# EAGLE design Stepper_1_0 (EAGLE 8.0.0)
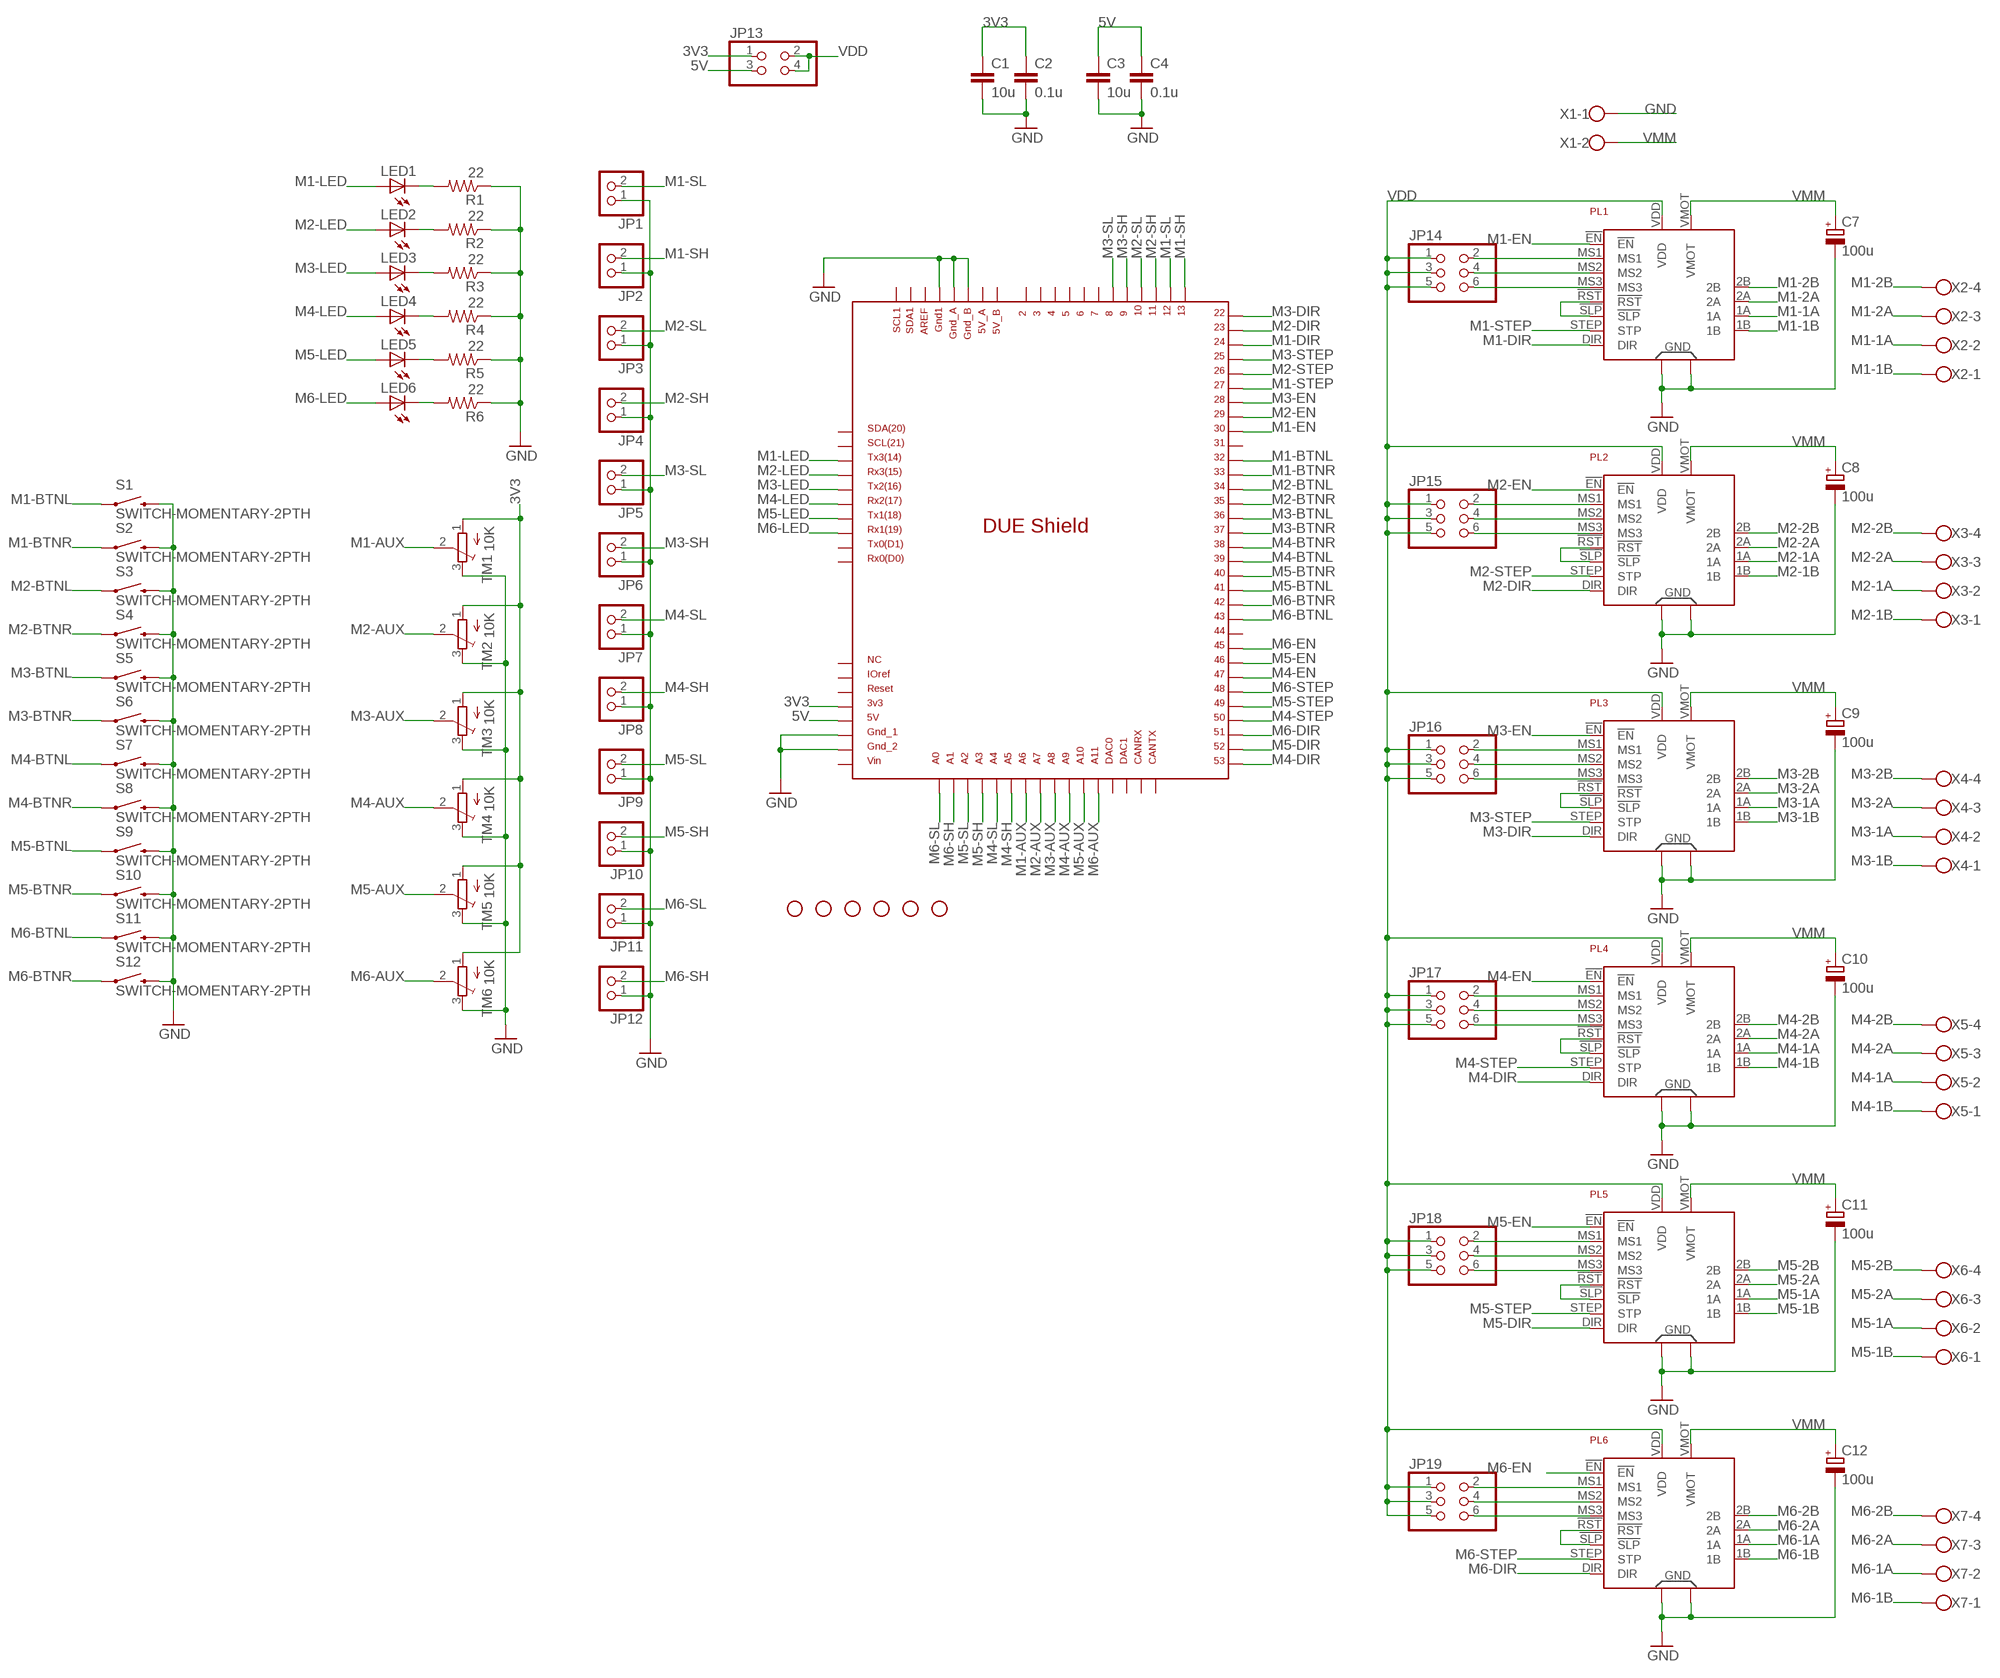
[diagram p0: schematic, sheet 1]

## Parts
C1  10u  CAP1206  [1206]
C2  0.1u  CAP1206  [1206]
C3  10u  CAP1206  [1206]
C4  0.1u  CAP1206  [1206]
C7  100u  CPOL-EUETR2  [ETR2]
C8  100u  CPOL-EUETR2  [ETR2]
C9  100u  CPOL-EUETR2  [ETR2]
C10  100u  CPOL-EUETR2  [ETR2]
C11  100u  CPOL-EUETR2  [ETR2]
C12  100u  CPOL-EUETR2  [ETR2]
H1  STAND-OFF  [STAND-OFF]
H2  STAND-OFF  [STAND-OFF]
H3  STAND-OFF  [STAND-OFF]
H4  STAND-OFF  [STAND-OFF]
H5  STAND-OFF  [STAND-OFF]
H6  STAND-OFF  [STAND-OFF]
JP1  PINHD-1X2  [1X02]
JP2  PINHD-1X2  [1X02]
JP3  PINHD-1X2  [1X02]
JP4  PINHD-1X2  [1X02]
JP5  PINHD-1X2  [1X02]
JP6  PINHD-1X2  [1X02]
JP7  PINHD-1X2  [1X02]
JP8  PINHD-1X2  [1X02]
JP9  PINHD-1X2  [1X02]
JP10  PINHD-1X2  [1X02]
JP11  PINHD-1X2  [1X02]
JP12  PINHD-1X2  [1X02]
JP13  PINHD-2X2  [2X02]
JP14  PINHD-2X3  [2X03]
JP15  PINHD-2X3  [2X03]
JP16  PINHD-2X3  [2X03]
JP17  PINHD-2X3  [2X03]
JP18  PINHD-2X3  [2X03]
JP19  PINHD-2X3  [2X03]
LED1  LEDSMT1206  [1206]
LED2  LEDSMT1206  [1206]
LED3  LEDSMT1206  [1206]
LED4  LEDSMT1206  [1206]
LED5  LEDSMT1206  [1206]
LED6  LEDSMT1206  [1206]
PL1  A4988X  [MD09X]
PL2  A4988X  [MD09X]
PL3  A4988X  [MD09X]
PL4  A4988X  [MD09X]
PL5  A4988X  [MD09X]
PL6  A4988X  [MD09X]
R1  22  RESISTOR1206  [1206]
R2  22  RESISTOR1206  [1206]
R3  22  RESISTOR1206  [1206]
R4  22  RESISTOR1206  [1206]
R5  22  RESISTOR1206  [1206]
R6  22  RESISTOR1206  [1206]
S1  SWITCH-MOMENTARY-2PTH  [TACTILE-PTH]
S2  SWITCH-MOMENTARY-2PTH  [TACTILE-PTH]
S3  SWITCH-MOMENTARY-2PTH  [TACTILE-PTH]
S4  SWITCH-MOMENTARY-2PTH  [TACTILE-PTH]
S5  SWITCH-MOMENTARY-2PTH  [TACTILE-PTH]
S6  SWITCH-MOMENTARY-2PTH  [TACTILE-PTH]
S7  SWITCH-MOMENTARY-2PTH  [TACTILE-PTH]
S8  SWITCH-MOMENTARY-2PTH  [TACTILE-PTH]
S9  SWITCH-MOMENTARY-2PTH  [TACTILE-PTH]
S10  SWITCH-MOMENTARY-2PTH  [TACTILE-PTH]
S11  SWITCH-MOMENTARY-2PTH  [TACTILE-PTH]
S12  SWITCH-MOMENTARY-2PTH  [TACTILE-PTH]
SH1  DUE(NOSPI)  [DUE(NOSPI)]
TM1  10K  TRIMPOTTC33X  [TC33X]
TM2  10K  TRIMPOTTC33X  [TC33X]
TM3  10K  TRIMPOTTC33X  [TC33X]
TM4  10K  TRIMPOTTC33X  [TC33X]
TM5  10K  TRIMPOTTC33X  [TC33X]
TM6  10K  TRIMPOTTC33X  [TC33X]
X1  W237-102  [W237-102]
X2  W237-4  [W237-4]
X3  W237-4  [W237-4]
X4  W237-4  [W237-4]
X5  W237-4  [W237-4]
X6  W237-4  [W237-4]
X7  W237-4  [W237-4]

## Nets
3V3: C1.1 C2.1 JP13.1 SH1.3V3 TM1.1(A) TM2.1(A) TM3.1(A) TM4.1(A) TM5.1(A) TM6.1(A)
5V: C3.1 C4.1 JP13.3 SH1.5V
GND: C1.2 C2.2 C3.2 C4.2 C7.- C8.- C9.- C10.- C11.- C12.- JP1.1 JP2.1 JP3.1 JP4.1 JP5.1 JP6.1 JP7.1 JP8.1 JP9.1 JP10.1 JP11.1 JP12.1 PL1.GND1 PL1.GND2 PL2.GND1 PL2.GND2 PL3.GND1 PL3.GND2 PL4.GND1 PL4.GND2 PL5.GND1 PL5.GND2 PL6.GND1 PL6.GND2 R1.1 R2.1 R3.1 R4.1 R5.1 R6.1 S1.3 S2.3 S3.3 S4.3 S5.3 S6.3 S7.3 S8.3 S9.3 S10.3 S11.3 S12.3 SH1.GND1 SH1.GND_1 SH1.GND_2 SH1.GND_A SH1.GND_B TM1.3(E) TM2.3(E) TM3.3(E) TM4.3(E) TM5.3(E) TM6.3(E) X1.1
M1-1A: PL1.1A X2.2
M1-1B: PL1.1B X2.1
M1-2A: PL1.2A X2.3
M1-2B: PL1.2B X2.4
M1-AUX: SH1.A6 TM1.2(S)
M1-BTNL: S1.1 SH1.32
M1-BTNR: S2.1 SH1.33
M1-DIR: PL1.DIR SH1.24
M1-EN: PL1.!EN SH1.30
M1-LED: LED1.A SH1.TX3
M1-SH: JP2.2 SH1.13
M1-SL: JP1.2 SH1.12
M1-STEP: PL1.STEP(STP) SH1.27
M2-1A: PL2.1A X3.2
M2-1B: PL2.1B X3.1
M2-2A: PL2.2A X3.3
M2-2B: PL2.2B X3.4
M2-AUX: SH1.A7 TM2.2(S)
M2-BTNL: S3.1 SH1.34
M2-BTNR: S4.1 SH1.35
M2-DIR: PL2.DIR SH1.23
M2-EN: PL2.!EN SH1.29
M2-LED: LED2.A SH1.RX3
M2-SH: JP4.2 SH1.11
M2-SL: JP3.2 SH1.10
M2-STEP: PL2.STEP(STP) SH1.26
M3-1A: PL3.1A X4.2
M3-1B: PL3.1B X4.1
M3-2A: PL3.2A X4.3
M3-2B: PL3.2B X4.4
M3-AUX: SH1.A8 TM3.2(S)
M3-BTNL: S5.1 SH1.36
M3-BTNR: S6.1 SH1.37
M3-DIR: PL3.DIR SH1.22
M3-EN: PL3.!EN SH1.28
M3-LED: LED3.A SH1.TX2
M3-SH: JP6.2 SH1.9
M3-SL: JP5.2 SH1.8
M3-STEP: PL3.STEP(STP) SH1.25
M4-1A: PL4.1A X5.2
M4-1B: PL4.1B X5.1
M4-2A: PL4.2A X5.3
M4-2B: PL4.2B X5.4
M4-AUX: SH1.A9 TM4.2(S)
M4-BTNL: S7.1 SH1.39
M4-BTNR: S8.1 SH1.38
M4-DIR: PL4.DIR SH1.53
M4-EN: PL4.!EN SH1.47
M4-LED: LED4.A SH1.RX2
M4-SH: JP8.2 SH1.A5
M4-SL: JP7.2 SH1.A4
M4-STEP: PL4.STEP(STP) SH1.50
M5-1A: PL5.1A X6.2
M5-1B: PL5.1B X6.1
M5-2A: PL5.2A X6.3
M5-2B: PL5.2B X6.4
M5-AUX: SH1.A10 TM5.2(S)
M5-BTNL: S9.1 SH1.41
M5-BTNR: S10.1 SH1.40
M5-DIR: PL5.DIR SH1.52
M5-EN: PL5.!EN SH1.46
M5-LED: LED5.A SH1.TX1
M5-SH: JP10.2 SH1.A3
M5-SL: JP9.2 SH1.A2
M5-STEP: PL5.STEP(STP) SH1.49
M6-1A: PL6.1A X7.2
M6-1B: PL6.1B X7.1
M6-2A: PL6.2A X7.3
M6-2B: PL6.2B X7.4
M6-AUX: SH1.A11 TM6.2(S)
M6-BTNL: S11.1 SH1.43
M6-BTNR: S12.1 SH1.42
M6-DIR: PL6.DIR SH1.51
M6-EN: PL6.!EN SH1.45
M6-LED: LED6.A SH1.RX1
M6-SH: JP12.2 SH1.A1
M6-SL: JP11.2 SH1.A0
M6-STEP: PL6.STEP(STP) SH1.48
N$1: JP15.2 PL2.MS1
N$6: PL1.!RST PL1.!SLP
N$7: JP15.6 PL2.MS3
N$8: JP15.4 PL2.MS2
N$13: PL2.!RST PL2.!SLP
N$14: PL3.!RST PL3.!SLP
N$15: JP16.6 PL3.MS3
N$16: JP16.4 PL3.MS2
N$21: PL4.!RST PL4.!SLP
N$22: JP14.6 PL1.MS3
N$23: JP14.4 PL1.MS2
N$24: JP14.2 PL1.MS1
N$26: JP16.2 PL3.MS1
N$33: JP17.6 PL4.MS3
N$34: JP17.4 PL4.MS2
N$35: JP17.2 PL4.MS1
N$37: JP18.6 PL5.MS3
N$38: JP18.4 PL5.MS2
N$39: JP18.2 PL5.MS1
N$44: JP19.6 PL6.MS3
N$45: JP19.4 PL6.MS2
N$46: JP19.2 PL6.MS1
N$47: PL5.!RST PL5.!SLP
N$48: PL6.!RST PL6.!SLP
N$49: LED1.C R1.2
N$50: LED2.C R2.2
N$51: LED3.C R3.2
N$52: LED4.C R4.2
N$53: LED5.C R5.2
N$54: LED6.C R6.2
VDD: JP13.2 JP13.4 JP14.1 JP14.3 JP14.5 JP15.1 JP15.3 JP15.5 JP16.1 JP16.3 JP16.5 JP17.1 JP17.3 JP17.5 JP18.1 JP18.3 JP18.5 JP19.1 JP19.3 JP19.5 PL1.VDD PL2.VDD PL3.VDD PL4.VDD PL5.VDD PL6.VDD
VMM: C7.+ C8.+ C9.+ C10.+ C11.+ C12.+ PL1.VMOT PL2.VMOT PL3.VMOT PL4.VMOT PL5.VMOT PL6.VMOT X1.2
Unconnected: SH1.2 SH1.3 SH1.4 SH1.5 SH1.5V_A SH1.5V_B SH1.6 SH1.7 SH1.31 SH1.44 SH1.AREF SH1.CANRX SH1.CANTX SH1.DAC0 SH1.DAC1 SH1.IOREF SH1.NC SH1.RESET SH1.RX0 SH1.SCL SH1.SCL1 SH1.SDA SH1.SDA1 SH1.TX0 SH1.VIN

## Library data of the parts
C1-C4 = SparkFun-Passives:CAP: Capacitor Standard 0603 ceramic capacitor, and 0.1" leaded capacitor.
C7-C12 = rcl:CPOL-EU: POLARIZED CAPACITOR, European symbol
H1-H6 = SparkFun-Electromechanical:STAND-OFF: #4 Stand Off This is the mechanical footprint for a #4 phillips button head screw. Use the keepout ring to avoid running the screw head into surrounding components. SKU : PRT-00447
JP1-JP12 = pinhead:PINHD-1X2: PIN HEADER
JP13 = pinhead:PINHD-2X2: PIN HEADER
JP14-JP19 = pinhead:PINHD-2X3: PIN HEADER
LED1-LED6 = adafruit:LED: LED OSRAM: - CHIPLED LG R971, LG N971, LY N971, LG Q971, LY Q971, LO R971, LY R971 LH N974, LH R974 LS Q976, LO Q976, LY Q976 LO Q996 - Hyper CHIPLED LW Q18S LB Q993, LB Q99A, LB R99A - SideLED LS A670, LO A670, LY A670, LG A670, LP A670 LB A673, LV A673, LT A673, LW A673 LH A674 LY A675 LS A676, LA A676, LO A676, LY A676, LW A676 LS A679, LY A679, LG A679 - Hyper Micro SIDELED® LS Y876, LA Y876, LO Y876, LY Y876 LT Y87S - SmartLED LW L88C, LW L88S LB L89C, LB L89S, LG L890 LS L89K, LO L89K, LY L89K LS L896, LA L896, LO L896, LY L896 - TOPLED LS T670, LO T670, LY T670, LG T670, LP T670 LSG T670, LSP T670, LSY T670, LOP T670, LYG T670 LG T671, LOG T671, LSG T671 LB T673, LV T673, LT T673, LW T673 LH T674 LS T676, LA T676, LO T676, LY T676, LB T676, LH T676, LSB T676, LW T676 LB T67C, LV T67C, LT T67C, LS T67K, LO T67K, LY T67K, LW E67C LS E67B, LA E67B, LO E67B, LY E67B, LB E67C, LV E67C, LT E67C LW T67C LS T679, LY T679, LG T679 LS T770, LO T770, LY T770, LG T770, LP T770 LB T773, LV T773, LT T773, LW T773 LH T774 LS E675, LA E675, LY E675, LS T675 LS T776, LA T776, LO T776, LY T776, LB T776 LHGB T686 LT T68C, LB T68C - Hyper Mini TOPLED® LB M676 - Mini TOPLED Santana® LG M470 LS M47K, LO M47K, LY M47K Source: http://www.osram.convergy.de/
PL1-PL6 = Pololu:A4988X
R1-R6 = SparkFun-Resistors:RESISTOR: Resistor Basic schematic elements and footprints for 0603, 1206, and PTH resistors.
S1-S12 = SparkFun-Electromechanical:SWITCH-MOMENTARY-2: Various NO switches- pushbuttons, reed, etc; PROD_ID: SWCH-08441
SH1 = JoshParts:DUE(NOSPI)
TM1-TM6 = adafruit:TRIMPOT: SMT trimmer potentiometer part number TC33X http://www.ladyada.net/library/eagle
X1 = cnc_control_V1:W237-102: WAGO SCREW CLAMP; MPN: 237-102; OC_FARNELL: unknown; OC_NEWARK: 70K9898
X2-X7 = con-wago-500:W237-4: WAGO SCREW CLAMP; OC_FARNELL: unknown; OC_NEWARK: unknown

## Board
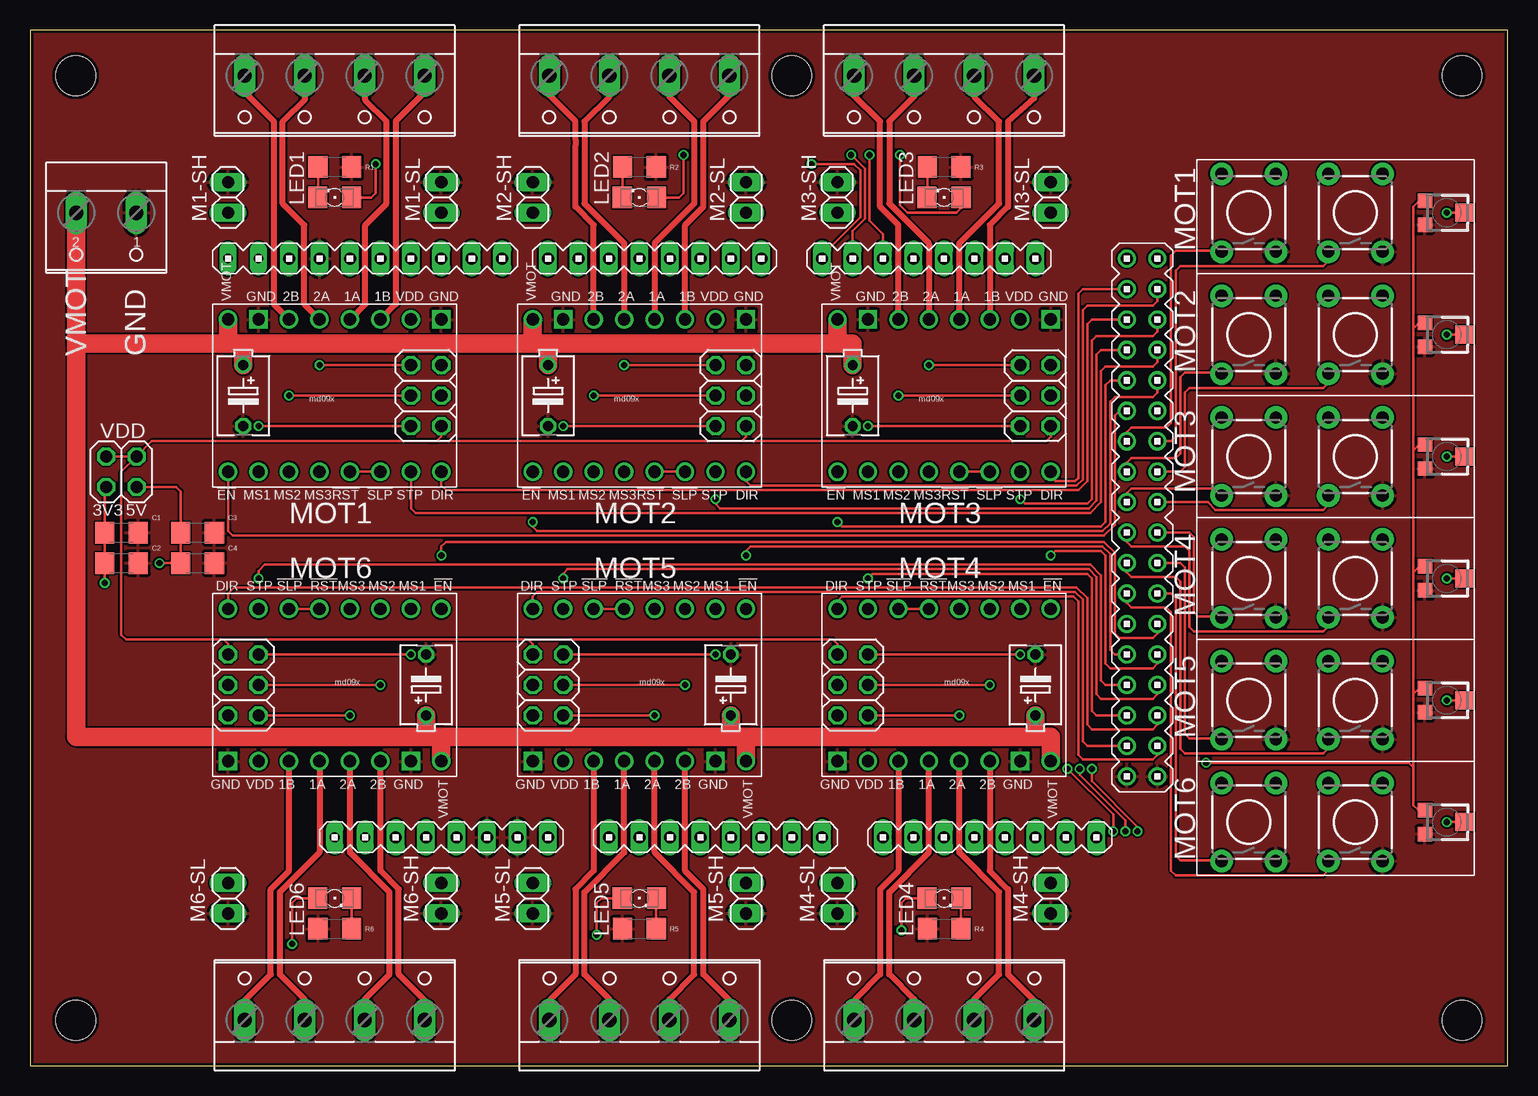
[diagram p1: board, top side]
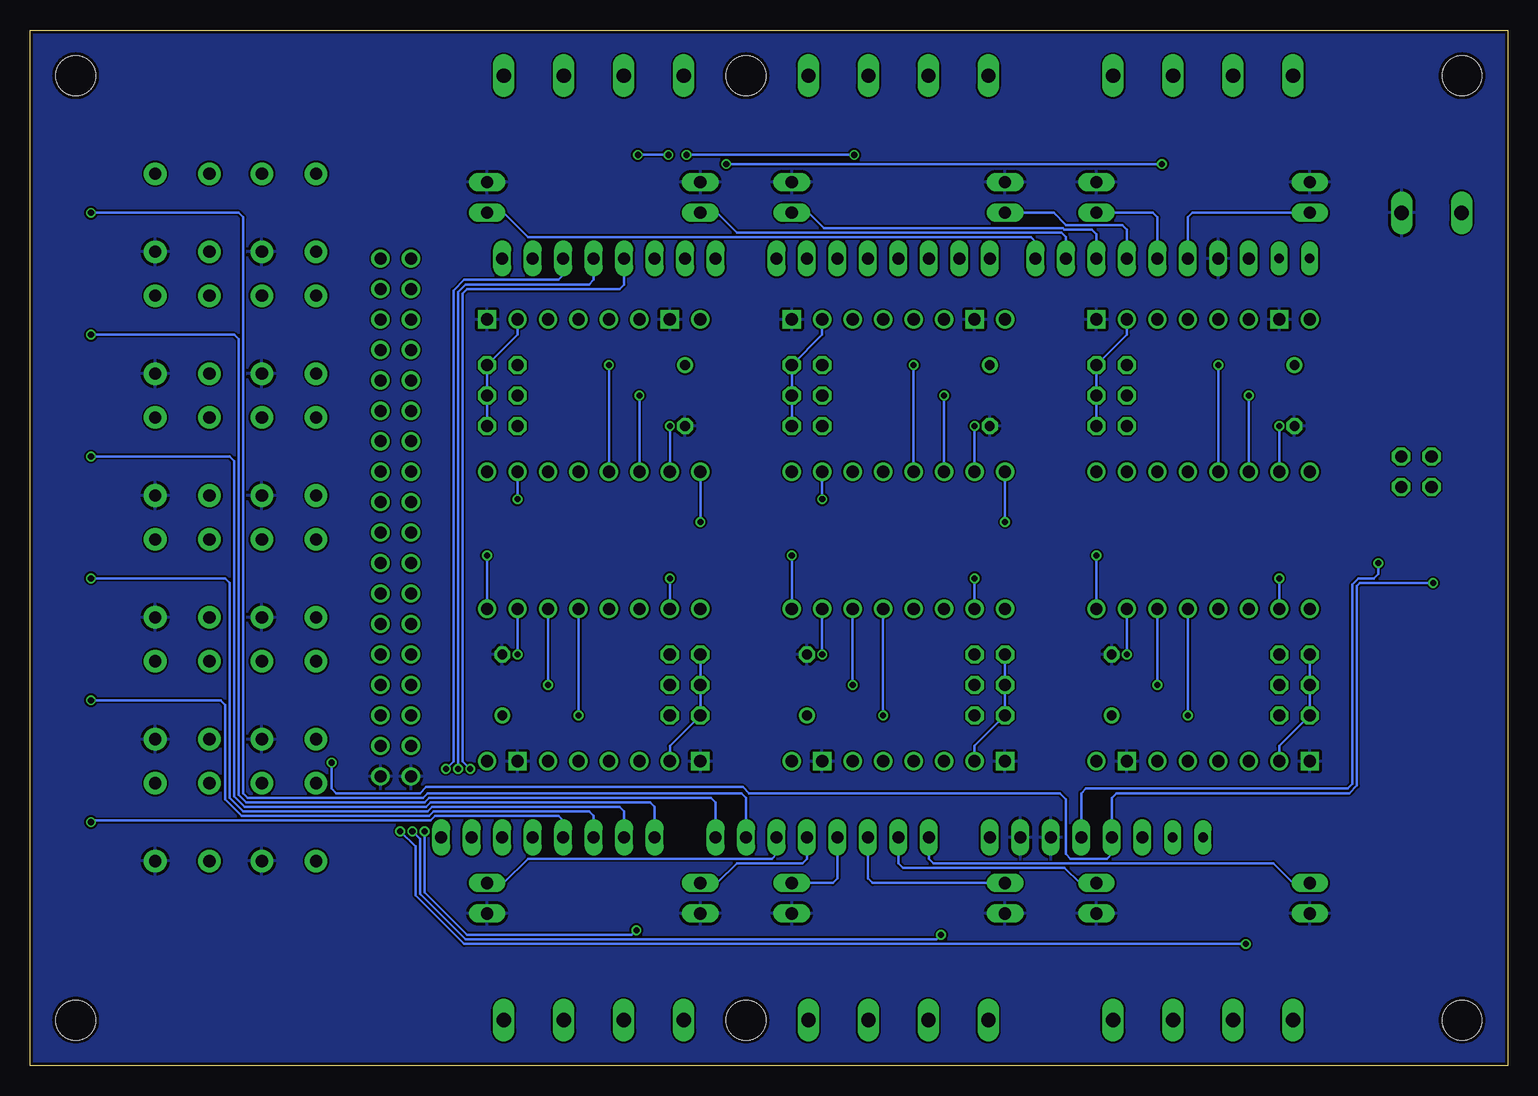
[diagram p2: board, bottom side, seen from below]

Size 123.19 x 86.36 mm. Coordinates in mm from the lower left corner, seen from the top.
Outline: 123.19,86.36 0,86.36 0,0 123.19,0 123.19,86.36
Copper layers (1*16): Top 0.035mm / dielectric 1.5mm / Bottom 0.035mm
Design rules "SeeedStudio_2layer_DRU_no_angle_20140221": minimum track width 6mil, minimum drill 12mil, track to track 6mil, track to pad 6mil, pad to pad 6mil, via to via 6mil, smd to smd 0mil, copper to edge 10mil, drill to drill 10mil, minimum pad ring 10mil, minimum via ring 6mil, stop-mask expansion 2mil, vias tented up to drill 100mil, thermal gap 10mil

### Footprints (pad centres in the part's own frame; a part is rotated, then mirrored left to right if it is on the bottom)
1206 = smd 1.6 x 1.8: 1 -1.4,0; 2 1.4,0
ETR2 = drill 0.813: + -2.54,0 | drill 0.813 octagon: - 2.54,0
STAND-OFF = hole 3.302: 0,0
1X02 = drill 1.016 long: 1 -1.27,0; 2 1.27,0
2X02 = drill 1.016 octagon: 1 -1.27,-1.27; 2 -1.27,1.27; 3 1.27,-1.27; 4 1.27,1.27
2X03 = drill 1.016 octagon: 1 -2.54,-1.27; 2 -2.54,1.27; 3 0,-1.27; 4 0,1.27; 5 2.54,-1.27; 6 2.54,1.27
1206' = smd 1.6 x 1.803: A -1.422,0; C 1.422,0
MD09X = drill 1.016: 1A 6.35,-1.27; 1B 6.35,-3.81; 2A 6.35,1.27; 2B 6.35,3.81; !EN -6.35,8.89; !RST -6.35,-1.27; !SLP -6.35,-3.81; DIR -6.35,-8.89; MS1 -6.35,6.35; MS2 -6.35,3.81; MS3 -6.35,1.27; STEP -6.35,-6.35; VDD 6.35,-6.35; VMOT 6.35,8.89 | drill 1.016 square: GND1 6.35,-8.89; GND2 6.35,6.35
TACTILE-PTH = drill 1.016 pad 1.88: 1 -3.251,2.261; 2 3.251,2.261; 3 -3.251,-2.261; 4 3.251,-2.261
DUE(NOSPI) = drill 1 long: 2 -16.51,30.48; 3 -19.05,30.48; 3V3 -39.37,-17.78; 4 -21.59,30.48; 5 -24.13,30.48; 5V -36.83,-17.78; 6 -26.67,30.48; 7 -29.21,30.48; 8 -33.02,30.48; 9 -35.56,30.48; 10 -38.1,30.48; 11 -40.64,30.48; 12 -43.18,30.48; 13 -45.72,30.48; A0 -24.13,-17.78; A1 -21.59,-17.78; A2 -19.05,-17.78; A3 -16.51,-17.78; A4 -13.97,-17.78; A5 -11.43,-17.78; A6 -8.89,-17.78; A7 -6.35,-17.78; A8 -1.27,-17.78; A9 1.27,-17.78; A10 3.81,-17.78; A11 6.35,-17.78; AREF -50.8,30.48; CANRX 13.97,-17.78; CANTX 16.51,-17.78; DAC0 8.89,-17.78; DAC1 11.43,-17.78; GND1 -48.26,30.48; GND_1 -34.29,-17.78; GND_2 -31.75,-17.78; RESET -41.91,-17.78; RX0 -11.43,30.48; RX1 6.35,30.48; RX2 1.27,30.48; RX3 -3.81,30.48; SCL 11.43,30.48; SDA 8.89,30.48; TX0 -13.97,30.48; TX1 3.81,30.48; TX2 -1.27,30.48; TX3 -6.35,30.48; VIN -29.21,-17.78 | drill 1: 5V_A 19.05,30.48; 5V_B 21.59,30.48; 22 19.05,27.94; 23 21.59,27.94; 24 19.05,25.4; 25 21.59,25.4; 26 19.05,22.86; 27 21.59,22.86; 28 19.05,20.32; 29 21.59,20.32; 30 19.05,17.78; 31 21.59,17.78; 32 19.05,15.24; 33 21.59,15.24; 34 19.05,12.7; 35 21.59,12.7; 36 19.05,10.16; 37 21.59,10.16; 38 19.05,7.62; 39 21.59,7.62; 40 19.05,5.08; 41 21.59,5.08; 42 19.05,2.54; 43 21.59,2.54; 44 19.05,0; 45 21.59,0; 46 19.05,-2.54; 47 21.59,-2.54; 48 19.05,-5.08; 49 21.59,-5.08; 50 19.05,-7.62; 51 21.59,-7.62; 52 19.05,-10.16; 53 21.59,-10.16; GND_A 19.05,-12.7; GND_B 21.59,-12.7 | drill 0.8 pad 1.422 long: IOREF -44.45,-17.78; NC -46.99,-17.78; SCL1 -55.88,30.48; SDA1 -53.34,30.48
TC33X = smd 1.2 x 1.2: 1 -1,-1.825; 3 1,-1.825 | smd 1.5 x 1.6: 2 0,1.5
W237-102 = drill 1.194 long: 1 -2.5,-1.27; 2 2.5,-1.27
W237-4 = drill 1.194 long: 1 -7.5,-1.27; 2 -2.5,-1.27; 3 2.5,-1.27; 4 7.5,-1.27

### Placement (x,y rotation side)
C1  7.62,44.45 0 top
C2  7.62,41.91 0 top
C3  13.97,44.45 0 top
C4  13.97,41.91 0 top
C7  17.78,55.88 270 top
C8  43.18,55.88 270 top
C9  68.58,55.88 270 top
C10  83.82,31.75 90 top
C11  58.42,31.75 90 top
C12  33.02,31.75 90 top
H1  3.81,3.81 0 top
H2  119.38,3.81 0 top
H3  119.38,82.55 0 top
H4  3.81,82.55 0 top
H5  63.5,82.55 0 top
H6  63.5,3.81 0 top
JP1  34.29,72.39 270 top
JP2  16.51,72.39 270 top
JP3  59.69,72.39 270 top
JP4  41.91,72.39 270 top
JP5  85.09,72.39 270 top
JP6  67.31,72.39 270 top
JP7  67.31,13.97 90 top
JP8  85.09,13.97 90 top
JP9  41.91,13.97 90 top
JP10  59.69,13.97 90 top
JP11  16.51,13.97 90 top
JP12  34.29,13.97 90 top
JP13  7.62,49.53 0 top
JP14  33.02,55.88 90 top
JP15  58.42,55.88 90 top
JP16  83.82,55.88 90 top
JP17  68.58,31.75 270 top
JP18  43.18,31.75 270 top
JP19  17.78,31.75 270 top
LED1  [1206']  25.4,72.39 180 top
LED2  [1206']  50.8,72.39 180 top
LED3  [1206']  76.2,72.39 180 top
LED4  [1206']  76.2,13.97 0 top
LED5  [1206']  50.8,13.97 0 top
LED6  [1206']  25.4,13.97 0 top
PL1  25.4,55.88 90 top
PL2  50.8,55.88 90 top
PL3  76.2,55.88 90 top
PL4  76.2,31.75 270 top
PL5  50.8,31.75 270 top
PL6  25.4,31.75 270 top
R1  25.4,74.93 180 top
R2  50.8,74.93 180 top
R3  76.2,74.93 180 top
R4  76.2,11.43 0 top
R5  50.8,11.43 0 top
R6  25.4,11.43 0 top
S1  101.6,71.12 90 top
S2  110.49,71.12 90 top
S3  101.6,60.96 90 top
S4  110.49,60.96 90 top
S5  101.6,50.8 90 top
S6  110.49,50.8 90 top
S7  101.6,40.64 90 top
S8  110.49,40.64 90 top
S9  101.6,30.48 90 top
S10  110.49,30.48 90 top
S11  101.6,20.32 90 top
S12  110.49,20.32 90 top
SH1  72.39,36.83 0 top
TM1  118.11,71.12 270 top
TM2  118.11,60.96 270 top
TM3  118.11,50.8 270 top
TM4  118.11,40.64 270 top
TM5  118.11,30.48 270 top
TM6  118.11,20.32 270 top
X1  6.35,69.85 180 top
X2  25.4,81.28 180 top
X3  50.8,81.28 180 top
X4  76.2,81.28 180 top
X5  76.2,5.08 0 top
X6  50.8,5.08 0 top
X7  25.4,5.08 0 top

### Tracks (layer width: path | path; a pad name or v marks a point on that pad's centre or on a via)
3V3  (via drill 0.51)
  Top 0.203: v6.22,40.26 C2.1 C1.1 6.22,48.13 JP13.1 | 116.33,21.37 TM6.1 115.71,21.32 115.32,21.72 115.32,24.89 | TM1.1 115.81,72.12 115.32,71.63 115.32,61.47 | TM2.1 115.81,61.96 115.32,61.47 | TM3.1 115.81,51.8 115.32,51.31 | TM4.1 115.81,41.64 115.32,41.15 | TM5.1 115.81,31.48 115.32,30.99 | 115.32,30.99 115.32,24.89 | 115.32,41.15 115.32,30.99 | 115.32,51.31 115.32,41.15 | 115.32,61.47 115.32,51.31 | 115.32,24.89 114.94,25.27 v98.04,25.27
  Bottom 0.203: v6.22,40.26 12.32,40.26 12.57,40.01 12.57,23.37 13.21,22.73 32.64,22.73 33.02,22.35 SH1.3V3 33.02,17.65 33.4,17.27 36.45,17.27 36.83,17.65 36.83,22.23 37.34,22.73 63.25,22.73 63.75,23.24 90.17,23.24 90.68,22.73 97.66,22.73 98.04,23.11 v98.04,25.27
5V  (via drill 0.51)
  Top 0.203: v10.79,41.91 C4.1 C3.1 12.57,47.88 12.19,48.26 JP13.3
  Bottom 0.203: SH1.5V 35.56,22.73 35.18,23.11 13.34,23.11 12.95,23.5 12.95,40.13 12.45,40.64 11.18,40.64 10.79,41.02 v10.79,41.91
GND
  Top 0.203: TM6.3 116.22,19.32
  pour Top: 0,0 123.19,0 123.19,86.36 0,86.36
  pour Bottom: 0,0 123.19,0 123.19,86.36 0,86.36
M1-1A
  Top 0.508: X2.2 27.94,82.51 27.94,80.52 29.72,78.74 29.72,71.88 27.94,70.1 27.94,63.5 PL1.1A
M1-1B
  Top 0.508: X2.1 32.9,81.16 30.48,78.74 30.48,63.5 PL1.1B
M1-2A
  Top 0.508: X2.3 22.9,80.56 21.08,78.74 21.08,71.88 22.86,70.1 22.86,63.5 PL1.2A
M1-2B
  Top 0.508: X2.4 17.78,82.43 17.78,81.28 20.32,78.74 20.32,63.5 PL1.2B
M1-AUX  (via drill 0.51 pad 0.76)
  Top 0.203: v118.11,71.12 TM1.2
  Bottom 0.203: v118.11,71.12 105.79,71.12 105.41,70.74 105.41,22.73 105.03,22.35 90.42,22.35 90.04,22.73 63.88,22.73 63.5,22.35 SH1.A6
M1-BTNL
  Top 0.203: SH1.32 91.44,52.83 91.82,53.21 94.74,53.21 95.12,53.59 95.12,67.56 95.5,67.94 99.26,67.94 S1.1
M1-BTNR
  Top 0.203: SH1.33 95.12,52.07 95.5,52.45 95.5,66.29 95.89,66.67 107.82,66.67 108.2,67.06 108.2,67.84 S2.1
M1-DIR
  Top 0.203: PL1.DIR 34.29,48.39 34.67,48.01 87.38,48.01 88.14,48.77 88.14,61.85 88.52,62.23 SH1.24
M1-EN
  Top 0.203: PL1.!EN 16.51,44.58 16.89,44.2 89.53,44.2 90.42,45.09 90.42,54.23 90.81,54.61 SH1.30
M1-LED  (via drill 0.51)
  Top 0.203: SH1.TX3 66.04,67.56 69.22,70.74 69.22,74.68 68.71,75.18 v65.15,75.18 | v28.83,75.18 28.83,72.77 28.45,72.39 LED1.A
  Bottom 0.203: v65.15,75.18 v28.83,75.18
M1-SH
  Bottom 0.203: SH1.13 26.67,70.74 26.29,71.12 JP2.2
M1-SL
  Bottom 0.203: SH1.12 29.21,70.74 29.59,71.12 JP1.2
M1-STEP
  Top 0.203: PL1.STEP 31.75,46.48 32.13,46.1 88.39,46.1 89.28,46.99 89.28,57.91 89.66,58.29 93.6,58.29 93.98,58.67 SH1.27
M2-1A
  Top 0.508: X3.2 53.3,80.81 55.37,78.74 55.37,71.88 52.07,68.58 PL2.1A
M2-1B
  Top 0.508: X3.1 58.3,80.91 56.13,78.74 56.13,71.63 54.61,70.1 PL2.1B
M2-2A
  Top 0.508: X3.3 48.3,80.81 46.23,78.74 46.23,71.88 49.53,68.58 PL2.2A
M2-2B
  Top 0.508: X3.4 43.3,80.91 45.47,78.74 45.47,77.22 45.47,76.71 45.47,71.63 46.99,70.1 PL2.2B
M2-AUX  (via drill 0.51 pad 0.76)
  Top 0.203: TM2.2 v118.11,60.96
  Bottom 0.203: v118.11,60.96 106.17,60.96 105.79,60.58 105.79,22.61 105.16,21.97 90.3,21.97 89.92,22.35 66.42,22.35 66.04,21.97 SH1.A7
M2-BTNL
  Top 0.203: SH1.34 91.44,50.29 91.82,50.67 95.5,50.67 95.89,51.05 95.89,57.4 96.27,57.78 99.26,57.78 S3.1
M2-BTNR
  Top 0.203: SH1.35 95.89,49.53 96.27,49.91 96.27,56.13 96.65,56.52 107.82,56.52 108.2,56.9 108.2,57.68 S4.1
M2-DIR
  Top 0.203: PL2.DIR 59.69,48.77 60.07,48.39 87.25,48.39 87.76,48.9 87.76,62.99 88.14,63.37 93.6,63.37 93.98,63.75 SH1.23
M2-EN  (via drill 0.51)
  Top 0.203: v41.91,45.34 41.91,44.96 42.29,44.58 89.41,44.58 90.04,45.21 90.04,55.37 90.42,55.75 93.6,55.75 93.98,56.13 SH1.29
  Bottom 0.203: PL2.!EN v41.91,45.34
M2-LED  (via drill 0.51)
  Top 0.203: SH1.RX3 68.58,69.6 69.6,70.61 69.6,74.8 v68.45,75.95 | v54.48,75.95 54.48,72.77 54.1,72.39 LED2.A
  Bottom 0.203: v68.45,75.95 v54.48,75.95
M2-SH
  Bottom 0.203: SH1.11 31.75,69.72 32.13,70.1 36.83,70.1 37.85,71.12 JP4.2
M2-SL
  Bottom 0.203: SH1.10 34.29,69.34 34.67,69.72 36.96,69.72 37.08,69.85 57.02,69.85 58.29,71.12 JP3.2
M2-STEP  (via drill 0.51)
  Top 0.203: v57.15,47.24 57.15,46.86 57.53,46.48 88.27,46.48 88.9,47.12 88.9,59.31 89.28,59.69 SH1.26
  Bottom 0.203: PL2.STEP v57.15,47.24
M3-1A
  Top 0.508: X4.2 78.74,82.51 78.74,80.77 80.77,78.74 80.77,71.88 77.47,68.58 PL3.1A
M3-1B
  Top 0.508: X4.1 83.7,80.65 81.53,78.74 81.53,71.63 80.01,70.1 PL3.1B
M3-2A
  Top 0.508: X4.3 73.7,80.81 71.63,78.74 71.63,71.88 74.93,68.58 PL3.2A
M3-2B
  Top 0.508: X4.4 68.58,82.43 68.58,81.03 70.87,78.74 70.87,71.63 72.39,70.1 PL3.2B
M3-AUX  (via drill 0.51 pad 0.76)
  Top 0.203: v118.11,50.8 TM3.2
  Bottom 0.203: v118.11,50.8 106.55,50.8 106.17,50.42 106.17,22.48 105.28,21.59 90.17,21.59 89.79,21.97 71.5,21.97 71.12,21.59 SH1.A8
M3-BTNL
  Top 0.203: SH1.36 91.44,47.75 91.82,48.13 98.75,48.13 S5.1
M3-BTNR
  Top 0.203: SH1.37 98.17,46.99 98.81,46.35 107.82,46.35 108.2,46.74 108.2,47.52 S6.1
M3-DIR
  Top 0.203: PL3.DIR 85.09,49.15 85.47,48.77 87.12,48.77 87.38,49.02 87.38,64.39 87.76,64.77 SH1.22
M3-EN  (via drill 0.51)
  Top 0.203: v67.31,45.34 67.69,44.96 89.28,44.96 89.66,45.34 89.66,56.77 90.04,57.15 SH1.28
  Bottom 0.203: PL3.!EN v67.31,45.34
M3-LED  (via drill 0.51)
  Top 0.203: SH1.TX2 71.12,69.34 69.98,70.48 v69.98,75.95 | v72.52,75.95 72.52,71.75 73.15,71.12 77.22,71.12 77.6,71.5 77.6,72.36 LED3.A
  Bottom 0.203: v69.98,75.95 v72.52,75.95
M3-SH
  Bottom 0.203: SH1.9 36.83,69.09 37.21,69.47 64.26,69.47 65.91,71.12 JP6.2
M3-SL
  Bottom 0.203: SH1.8 39.37,68.71 39.75,69.09 81.66,69.09 83.69,71.12 JP5.2
M3-STEP  (via drill 0.51)
  Top 0.203: v82.55,47.24 82.93,46.86 88.14,46.86 88.52,47.24 88.52,60.45 88.9,60.83 93.6,60.83 93.98,61.21 SH1.25
  Bottom 0.203: PL3.STEP v82.55,47.24
M4-1A
  Top 0.508: X5.2 73.7,5.55 71.63,7.62 71.63,14.48 74.93,17.78 PL4.1A
M4-1B
  Top 0.508: PL4.1B 72.39,16.26 70.87,14.73 70.87,7.62 68.83,5.59 68.83,3.94 X5.1
M4-2A
  Top 0.508: X5.3 78.7,5.55 80.77,7.62 80.77,14.48 77.47,17.78 PL4.2A
M4-2B
  Top 0.508: PL4.2B 80.01,16.26 81.53,14.73 81.53,7.62 83.82,5.33 83.82,3.93 X5.4
M4-AUX  (via drill 0.51 pad 0.76)
  Top 0.203: v118.11,40.64 TM4.2
  Bottom 0.203: v118.11,40.64 106.93,40.64 106.55,40.26 106.55,22.35 105.41,21.21 90.04,21.21 89.66,21.59 74.04,21.59 73.66,21.21 SH1.A9
M4-BTNL
  Top 0.203: SH1.39 96.65,44.45 97.03,44.07 97.03,37.85 97.41,37.47 99.26,37.47 S7.1
M4-BTNR
  Top 0.203: SH1.38 91.44,43.69 91.82,43.31 96.27,43.31 96.65,42.93 96.65,36.58 97.03,36.2 107.82,36.2 108.2,36.58 108.2,37.36 S8.1
M4-DIR
  Top 0.203: PL4.DIR 67.31,38.73 67.69,39.12 87,39.12 87.38,38.73 87.38,25.91 87.76,25.53 93.6,25.53 93.98,25.91 SH1.53
M4-EN  (via drill 0.51)
  Top 0.203: v85.09,42.55 85.47,42.93 89.28,42.93 89.66,42.55 89.66,33.53 90.04,33.15 93.6,33.15 93.98,33.53 SH1.47
  Bottom 0.203: PL4.!EN v85.09,42.55
M4-LED  (via drill 0.51)
  Top 0.203: LED4.A 73.03,13.97 72.64,13.59 v72.64,11.3 | v90.3,19.56 90.3,20.95 v86.49,24.77
  Bottom 0.203: v72.64,11.3 73.03,10.92 86.74,10.92 90.3,14.48 v90.3,19.56 | v86.49,24.77 87.12,25.4 87.12,64.39 86.74,64.77 74.04,64.77 73.66,65.15 SH1.RX2
M4-SH
  Bottom 0.203: SH1.A5 60.96,17.65 61.34,17.27 81.66,17.27 83.69,15.24 JP8.2
M4-SL
  Bottom 0.203: SH1.A4 58.42,17.27 58.8,16.89 64.26,16.89 65.91,15.24 JP7.2
M4-STEP  (via drill 0.51)
  Top 0.203: v69.85,40.64 70.23,41.02 88.14,41.02 88.52,40.64 88.52,29.59 88.9,29.21 SH1.50
  Bottom 0.203: PL4.STEP v69.85,40.64
M5-1A
  Top 0.508: X6.2 48.3,5.55 46.23,7.62 46.23,14.48 49.53,17.78 PL5.1A
M5-1B
  Top 0.508: PL5.1B 46.99,16.26 45.47,14.73 45.47,7.62 43.43,5.59 43.43,3.93 X6.1
M5-2A
  Top 0.508: X6.3 53.3,5.55 55.37,7.62 55.37,14.48 52.07,17.78 PL5.2A
M5-2B
  Top 0.508: X6.4 58.3,5.45 56.13,7.62 56.13,14.73 54.61,16.26 PL5.2B
M5-AUX  (via drill 0.51 pad 0.76)
  Top 0.203: v118.11,30.48 TM5.2
  Bottom 0.203: v118.11,30.48 107.31,30.48 106.93,30.1 106.93,22.23 105.54,20.83 89.92,20.83 89.53,21.21 76.58,21.21 76.2,20.83 SH1.A10
M5-BTNL
  Top 0.203: SH1.41 95.89,41.91 96.27,41.53 96.27,27.69 96.65,27.3 99.26,27.3 S9.1
M5-BTNR
  Top 0.203: SH1.40 91.44,41.15 91.82,40.77 95.5,40.77 95.89,40.39 95.89,26.42 96.27,26.04 107.82,26.04 108.2,26.42 108.2,27.2 S10.1
M5-DIR
  Top 0.203: PL5.DIR 41.91,39.12 42.29,39.5 87.12,39.5 87.76,38.86 87.76,27.05 88.14,26.67 SH1.52
M5-EN  (via drill 0.51)
  Top 0.203: v59.69,42.55 59.69,42.93 60.07,43.31 89.41,43.31 90.04,42.67 90.04,34.67 90.42,34.29 SH1.46
  Bottom 0.203: PL5.!EN v59.69,42.55
M5-LED  (via drill 0.51)
  Top 0.203: LED5.A 47.62,13.97 47.24,13.59 v47.24,10.92 | v91.31,19.56 91.31,20.45 87.5,24.26 v87.5,24.77
  Bottom 0.203: v47.24,10.92 47.62,10.54 86.87,10.54 90.68,14.35 90.68,18.92 v91.31,19.56 | v87.5,24.77 87.5,64.52 86.87,65.15 76.58,65.15 76.2,65.53 SH1.TX1
M5-SH
  Bottom 0.203: SH1.A3 55.88,15.62 56.26,15.24 JP10.2
M5-SL
  Bottom 0.203: JP9.2 52.96,15.24 53.34,15.62 SH1.A2
M5-STEP  (via drill 0.51)
  Top 0.203: v44.45,40.64 44.45,41.02 44.83,41.4 88.27,41.4 88.9,40.77 88.9,30.99 89.28,30.61 93.6,30.61 93.98,30.99 SH1.49
  Bottom 0.203: PL5.STEP v44.45,40.64
M6-1A
  Top 0.508: PL6.1A 24.13,17.78 20.83,14.48 20.83,7.62 22.86,5.59 22.86,3.85 X7.2
M6-1B
  Top 0.508: X7.1 17.9,5.45 20.07,7.62 20.07,14.73 21.59,16.26 PL6.1B
M6-2A
  Top 0.508: X7.3 27.9,5.55 29.97,7.62 29.97,14.48 26.67,17.78 PL6.2A
M6-2B
  Top 0.508: X7.4 32.9,5.45 30.73,7.62 30.73,14.73 29.21,16.26 PL6.2B
M6-AUX  (via drill 0.51)
  Top 0.203: TM6.2 v118.11,20.32
  Bottom 0.203: v118.11,20.32 117.98,20.45 89.79,20.45 89.41,20.83 79.12,20.83 78.74,20.45 SH1.A11
M6-BTNL
  Top 0.203: SH1.43 95.12,39.37 95.5,38.99 95.5,17.53 95.89,17.14 99.26,17.14 S11.1
M6-BTNR
  Top 0.203: SH1.42 91.44,38.61 91.82,38.23 94.74,38.23 95.12,37.85 95.12,16.26 95.5,15.88 107.82,15.88 108.2,16.26 108.2,17.04 S12.1
M6-DIR
  Top 0.203: PL6.DIR 16.51,39.37 17.02,39.88 87.25,39.88 88.14,38.99 88.14,28.45 88.52,28.07 93.6,28.07 93.98,28.45 SH1.51
M6-EN  (via drill 0.51)
  Top 0.203: v34.29,42.55 34.29,43.31 34.67,43.69 89.53,43.69 90.42,42.8 90.42,36.07 90.81,35.69 93.6,35.69 93.98,36.07 SH1.45
  Bottom 0.203: PL6.!EN v34.29,42.55
M6-LED  (via drill 0.51)
  Top 0.203: LED6.A 22.23,13.97 21.84,13.59 v21.84,10.16 | v92.33,19.56 92.33,19.94 88.52,23.75 v88.52,24.77
  Bottom 0.203: v21.84,10.16 87,10.16 91.06,14.22 91.06,18.29 v92.33,19.56 | v88.52,24.77 87.88,25.4 87.88,64.64 87,65.53 79.12,65.53 78.74,65.91 SH1.RX1
M6-SH
  Bottom 0.203: SH1.A1 50.8,16.89 50.42,16.51 36.96,16.51 35.69,15.24 JP12.2
M6-SL
  Bottom 0.203: SH1.A0 48.26,17.27 47.88,16.89 19.56,16.89 17.91,15.24 JP11.2
M6-STEP  (via drill 0.51)
  Top 0.203: v19.05,40.64 19.05,41.27 19.56,41.78 88.39,41.78 89.28,40.89 89.28,32.13 89.66,31.75 SH1.48
  Bottom 0.203: PL6.STEP v19.05,40.64
N$1  (via drill 0.51 pad 0.76)
  Top 0.203: v44.45,53.34 JP15.2
  Bottom 0.203: PL2.MS1 v44.45,53.34
N$6
  Top 0.203: PL1.!RST PL1.!SLP
N$7  (via drill 0.51 pad 0.76)
  Top 0.203: v49.53,58.42 JP15.6
  Bottom 0.203: PL2.MS3 v49.53,58.42
N$8  (via drill 0.51 pad 0.76)
  Top 0.203: JP15.4 v46.99,55.88
  Bottom 0.203: v46.99,55.88 PL2.MS2
N$13
  Top 0.203: PL2.!RST PL2.!SLP
N$14
  Top 0.203: PL3.!RST PL3.!SLP
N$15  (via drill 0.51 pad 0.76)
  Top 0.203: JP16.6 v74.93,58.42
  Bottom 0.203: v74.93,58.42 PL3.MS3
N$16  (via drill 0.51 pad 0.76)
  Top 0.203: v72.39,55.88 JP16.4
  Bottom 0.203: PL3.MS2 v72.39,55.88
N$21
  Top 0.203: PL4.!SLP PL4.!RST
N$22  (via drill 0.51 pad 0.76)
  Top 0.203: JP14.6 v24.13,58.42
  Bottom 0.203: v24.13,58.42 PL1.MS3
N$23  (via drill 0.51 pad 0.76)
  Top 0.203: v21.59,55.88 JP14.4
  Bottom 0.203: PL1.MS2 v21.59,55.88
N$24  (via drill 0.51 pad 0.76)
  Top 0.203: JP14.2 v19.05,53.34
  Bottom 0.203: v19.05,53.34 PL1.MS1
N$26  (via drill 0.51 pad 0.76)
  Top 0.203: JP16.2 v69.85,53.34
  Bottom 0.203: v69.85,53.34 PL3.MS1
N$33  (via drill 0.51 pad 0.76)
  Top 0.203: v77.47,29.21 JP17.6
  Bottom 0.203: PL4.MS3 v77.47,29.21
N$34  (via drill 0.51 pad 0.76)
  Top 0.203: JP17.4 v80.01,31.75
  Bottom 0.203: v80.01,31.75 PL4.MS2
N$35  (via drill 0.51 pad 0.76)
  Top 0.203: v82.55,34.29 JP17.2
  Bottom 0.203: PL4.MS1 v82.55,34.29
N$37  (via drill 0.51 pad 0.76)
  Top 0.203: JP18.6 v52.07,29.21
  Bottom 0.203: v52.07,29.21 PL5.MS3
N$38  (via drill 0.51 pad 0.76)
  Top 0.203: v54.61,31.75 JP18.4
  Bottom 0.203: PL5.MS2 v54.61,31.75
N$39  (via drill 0.51 pad 0.76)
  Top 0.203: JP18.2 v57.15,34.29
  Bottom 0.203: v57.15,34.29 PL5.MS1
N$44  (via drill 0.51 pad 0.76)
  Top 0.203: v26.67,29.21 JP19.6
  Bottom 0.203: PL6.MS3 v26.67,29.21
N$45  (via drill 0.51 pad 0.76)
  Top 0.203: JP19.4 v29.21,31.75
  Bottom 0.203: v29.21,31.75 PL6.MS2
N$46  (via drill 0.51 pad 0.76)
  Top 0.203: v31.75,34.29 JP19.2
  Bottom 0.203: PL6.MS1 v31.75,34.29
N$47
  Top 0.203: PL5.!SLP PL5.!RST
N$48
  Top 0.203: PL6.!SLP PL6.!RST
N$49
  Top 0.203: R1.2 24,72.41 LED1.C
N$50
  Top 0.203: R2.2 49.4,72.41 LED2.C
N$51
  Top 0.203: R3.2 74.8,72.41 LED3.C
N$52
  Top 0.203: R4.2 77.6,13.95 LED4.C
N$53
  Top 0.203: R5.2 52.2,13.95 LED5.C
N$54
  Top 0.203: R6.2 26.8,13.95 LED6.C
VDD
  Top 0.203: JP18.1 41.91,35.18 41.53,35.56 41.02,35.56 | 41.02,35.56 16.13,35.56 | 16.13,35.56 8,35.56 7.62,35.94 7.62,49.53 JP13.4 | JP13.4 JP13.2 | JP19.1 16.51,35.18 16.13,35.56 | JP17.1 67.31,35.18 66.93,35.56 41.02,35.56 | JP14.1 34.29,52.45 33.91,52.07 33.27,52.07 | 33.27,52.07 10.16,52.07 JP13.4 | JP15.1 59.69,52.45 59.31,52.07 | 59.31,52.07 33.27,52.07 | JP16.1 85.09,52.45 84.71,52.07 59.31,52.07
  Bottom 0.203: JP16.1 JP16.3 JP16.5 82.55,60.96 PL3.VDD | JP15.1 JP15.3 JP15.5 57.15,60.96 PL2.VDD | JP14.1 JP14.3 JP14.5 31.75,60.96 PL1.VDD | JP18.1 JP18.3 JP18.5 44.45,26.67 PL5.VDD | JP19.1 JP19.3 JP19.5 19.05,26.67 PL6.VDD | JP17.1 JP17.3 JP17.5 69.85,26.67 PL4.VDD
VMM
  Top 1.524: PL4.VMOT 85.09,27.43 83.82,27.43 | 59.82,27.43 83.82,27.43 | 58.29,27.43 59.82,27.43 | 34.29,27.43 58.29,27.43 | 33.15,27.43 34.29,27.43 | C10.+ 83.82,27.43 | PL5.VMOT 59.69,27.43 59.82,27.43 | C11.+ 58.42,27.43 58.29,27.43 | PL6.VMOT 34.29,27.43 | C12.+ 33.02,27.43 33.15,27.43 | C9.+ 68.58,60.2 67.44,60.2 | 43.05,60.2 67.44,60.2 | 41.91,60.2 43.05,60.2 | 17.91,60.2 41.91,60.2 | 17.91,60.2 16.38,60.2 | PL3.VMOT 67.31,60.2 67.44,60.2 | C8.+ 43.18,60.2 43.05,60.2 | PL2.VMOT 41.91,60.2 | C7.+ 17.78,60.2 17.91,60.2 | PL1.VMOT 16.51,60.2 16.38,60.2 | 3.85,60.2 X1.2 | 3.85,60.2 3.85,27.43 33.15,27.43 | 16.38,60.2 3.85,60.2

### Text on the board
tPlace: M1-SH | M1-SL | M2-SH | M2-SL | M3-SH | M3-SL | MOT1 | VMOT | GND | MOT2 | VDD | MOT3 | 3V3 | 5V | MOT1 | MOT2 | MOT3 | MOT6 | MOT5 | MOT4 | MOT4 | MOT5 | MOT6 | M6-SL | M6-SH | M5-SL | M5-SH | M4-SL | M4-SH